# Altium schematic sheet controller.SchDoc
size A4; SheetNumber: 1; SheetTotal: 4
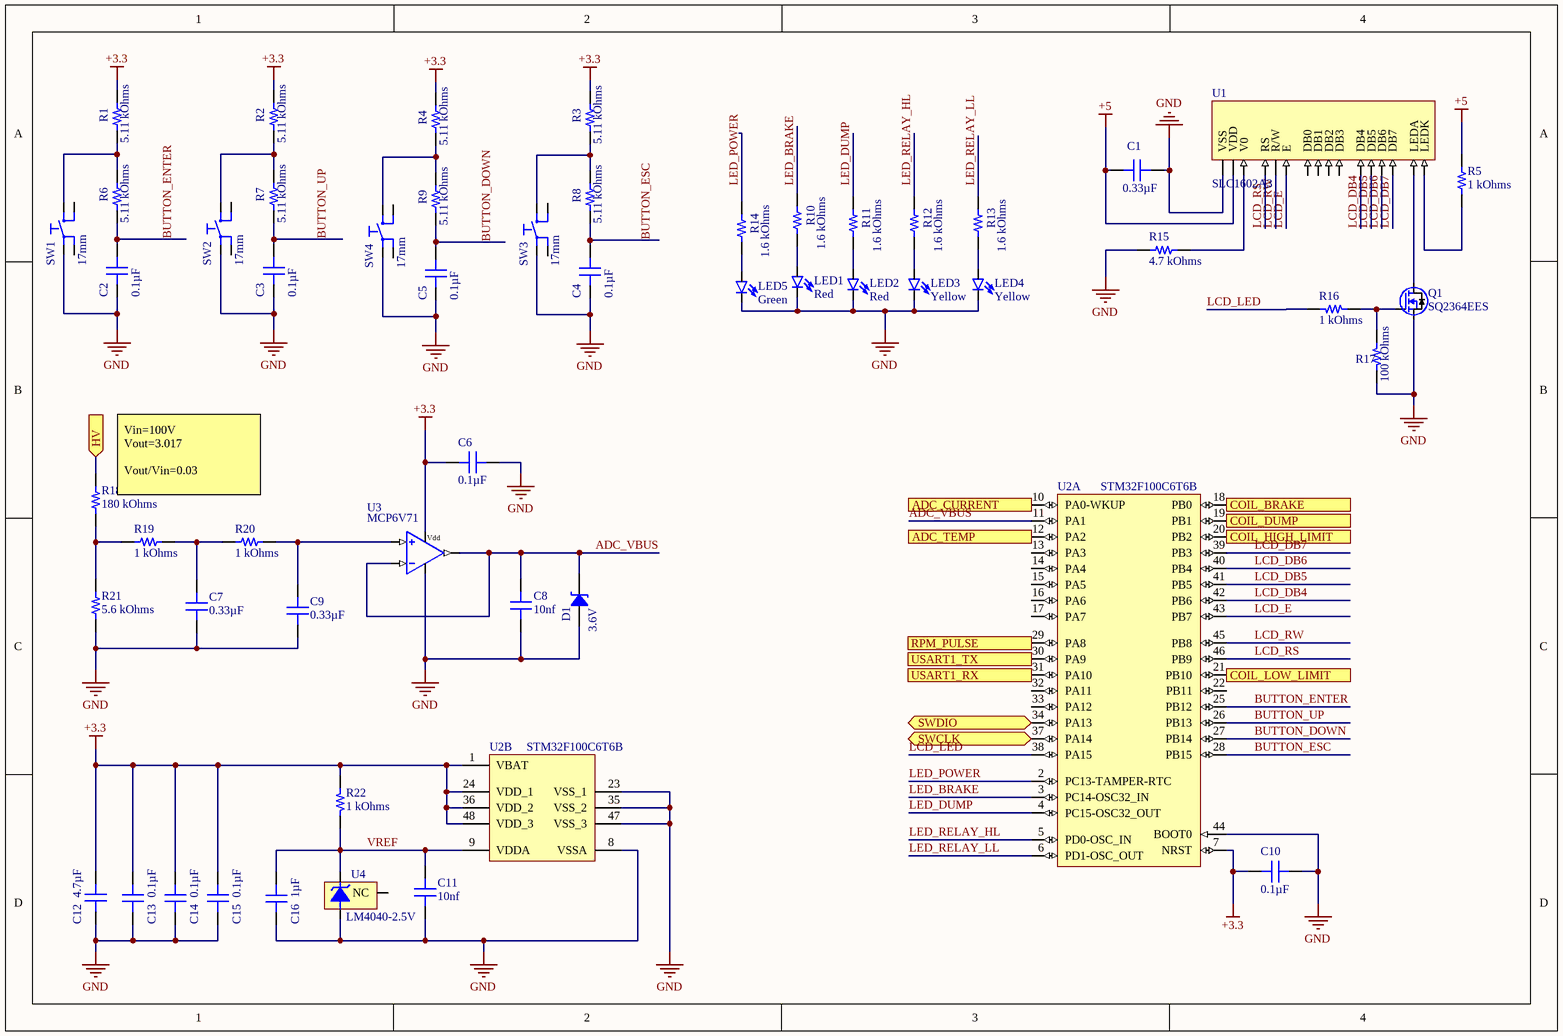
[diagram p0: controller.SchDoc]

## Parts
C1  0.33µF  [CAP 0805_2012]
C2  0.1µF  [CAP 0603_1608]
C3  0.1µF  [CAP 0603_1608]
C4  0.1µF  [CAP 0603_1608]
C5  0.1µF  [CAP 0603_1608]
C6  0.1µF  [CAP 0603_1608]
C7  0.33µF  [CAP 0805_2012]
C8  10nf  [CAP 0805_2012]
C9  0.33µF  [CAP 0805_2012]
C10  0.1µF  [CAP 0603_1608]
C11  10nf  [CAP 0402_1005]
C12  4.7µF  [CAP 0805_2012]
C13  0.1µF  [CAP 0603_1608]
C14  0.1µF  [CAP 0603_1608]
C15  0.1µF  [CAP 0603_1608]
C16  1µF  [CAP 0805_2012]
D1  3.6V  [SOD-123]
LED1  Red  [3mm LED THT]
LED2  Red  [3mm LED THT]
LED3  Yellow  [3mm LED THT]
LED4  Yellow  [3mm LED THT]
LED5  Green  [3mm LED THT]
Q1  SQ2364EES  [SOT23-(SQ2364EES)_H]
R1  5.11 kOhms  [RES 1206_3216]
R2  5.11 kOhms  [RES 1206_3216]
R3  5.11 kOhms  [RES 1206_3216]
R4  5.11 kOhms  [RES 1206_3216]
R5  1 kOhms  [RES 1206_3216]
R6  5.11 kOhms  [RES 1206_3216]
R7  5.11 kOhms  [RES 1206_3216]
R8  5.11 kOhms  [RES 1206_3216]
R9  5.11 kOhms  [RES 1206_3216]
R10  1.6 kOhms  [RES 1206_3216]
R11  1.6 kOhms  [RES 1206_3216]
R12  1.6 kOhms  [RES 1206_3216]
R13  1.6 kOhms  [RES 1206_3216]
R14  1.6 kOhms  [RES 1206_3216]
R15  4.7 kOhms  [RES 1206_3216]
R16  1 kOhms  [RES 1206_3216]
R17  100 kOhms  [RES 1206_3216]
R18  180 kOhms  [RES 1206_3216]
R19  1 kOhms  [RES 1206_3216]
R20  1 kOhms  [RES 1206_3216]
R21  5.6 kOhms  [RES 1206_3216]
R22  1 kOhms  [RES 1206_3216]
SW1  17mm  [6x6x17_THT]
SW2  17mm  [6x6x17_THT]
SW3  17mm  [6x6x17_THT]
SW4  17mm  [6x6x17_THT]
U1  SLC1602A3  [2x16 Lcd Top Left 36x80mm]
U2  STM32F100C6T6B  [STM-LQFP48_M]  (parts A,B of 2)
U3  MCP6V71  [SOT23-5-MCP6V71_H]
U4  LM4040-2.5V  [MF03A_L]

## Ports
ADC_CURRENT (in), ADC_TEMP (in), COIL_BRAKE (out), COIL_DUMP (out), COIL_HIGH_LIMIT (out), COIL_LOW_LIMIT (out), HV (in), RPM_PULSE (in), SWCLK (bidir), SWDIO (bidir), USART1_RX (in), USART1_TX (out)

## Nets
+3.3: C6.2 C10.2 C12.2 C13.2 C14.2 C15.2 R1.2 R2.2 R3.2 R4.2 R22.1 U2.1(VBAT) U2.7(NRST) U2.24(VDD_1) U2.36(VDD_2) U2.48(VDD_3) U3.5(VDD)
+5: C1.2 R5.2 U1.2(VDD)
GND: C1.1 C2.1 C3.1 C4.1 C5.1 C6.1 C7.1 C8.1 C9.1 C10.1 C11.1 C12.1 C13.1 C14.1 C15.1 C16.1 D1.1 LED1.A LED2.A LED3.A LED4.A LED5.A Q1.2(S) R15.1 R17.1 R21.1 SW1.1 SW2.1 SW3.1 SW4.1 U1.1(VSS) U2.8(VSSA) U2.23(VSS_1) U2.35(VSS_2) U2.44(BOOT0) U2.47(VSS_3) U3.2(VSS) U4.2(-V)
ADC_CURRENT: U2.10(PA0-WKUP) ; port ADC_CURRENT
ADC_TEMP: U2.12(PA2) ; port ADC_TEMP
ADC_VBUS: C8.2 D1.2 U2.11(PA1) U3.3(Vin(-)) U3.4(Out)
BUTTON_DOWN: C5.2 R9.1 U2.27(PB14)
BUTTON_ENTER: C2.2 R6.1 U2.25(PB12)
BUTTON_ESC: C4.2 R8.1 U2.28(PB15)
BUTTON_UP: C3.2 R7.1 U2.26(PB13)
COIL_BRAKE: U2.18(PB0) ; port COIL_BRAKE
COIL_DUMP: U2.19(PB1) ; port COIL_DUMP
COIL_HIGH_LIMIT: U2.20(PB2) ; port COIL_HIGH_LIMIT
COIL_LOW_LIMIT: U2.21(PB10) ; port COIL_LOW_LIMIT
HV: R18.2 ; port HV
LCD_DB4: U1.11(DB4) U2.42(PB6)
LCD_DB5: U1.12(DB5) U2.41(PB5)
LCD_DB6: U1.13(DB6) U2.40(PB4)
LCD_DB7: U1.14(DB7) U2.39(PB3)
LCD_E: U1.6(E) U2.43(PB7)
LCD_LED: R16.2 U2.38(PA15)
LCD_RS: U1.4(RS) U2.46(PB9)
LCD_RW: U1.5(R/W) U2.45(PB8)
LED_BRAKE: R10.2 U2.3(PC14-OSC32_IN)
LED_DUMP: R11.2 U2.4(PC15-OSC32_OUT)
LED_POWER: R14.2 U2.2(PC13-TAMPER-RTC)
LED_RELAY_HL: R12.2 U2.5(PD0-OSC_IN)
LED_RELAY_LL: R13.2 U2.6(PD1-OSC_OUT)
RPM_PULSE: U2.29(PA8) ; port RPM_PULSE
SWCLK: U2.37(PA14) ; port SWCLK
SWDIO: U2.34(PA13) ; port SWDIO
USART1_RX: U2.31(PA10) ; port USART1_RX
USART1_TX: U2.30(PA9) ; port USART1_TX
VREF: C11.2 C16.2 R22.2 U2.9(VDDA) U4.1(+V)
NetC7_2: C7.2 R19.2 R20.1
NetC9_2: C9.2 R20.2 U3.1(Vin(+))
NetLED1_C: LED1.C R10.1
NetLED2_C: LED2.C R11.1
NetLED3_C: LED3.C R12.1
NetLED4_C: LED4.C R13.1
NetLED5_C: LED5.C R14.1
NetQ1_1: Q1.1(G) R16.1 R17.2
NetQ1_3: Q1.3(D) U1.15(LEDA)
NetR1_1: R1.1 R6.2 SW1.2
NetR2_1: R2.1 R7.2 SW2.2
NetR3_1: R3.1 R8.2 SW3.2
NetR4_1: R4.1 R9.2 SW4.2
NetR5_1: R5.1 U1.16(LEDK)
NetR15_2: R15.2 U1.3(V0)
NetR18_1: R18.1 R19.1 R21.2

Not connected (* = marked no-connect by the designer): SW1 3 4; SW2 3 4; SW3 3 4; SW4 3 4; U1 7(DB0) 8(DB1) 9(DB2) 10(DB3); U2 13(PA3) 14(PA4) 15(PA5) 16(PA6) 17(PA7) 22(PB11) 32(PA11) 33(PA12); U4 3(NC)

## Notes on the sheet
- (near R18) Vin=100V
  Vout=3.017
  Vout/Vin=0.03
- (in symbol MCP6V71UT-E/LTY) Vdd

## Library data of the parts
C1 C7 C9 = C0805C334K5RECAUTO: CAP CER 0805 330NF 50V X7R 10%; Manufacturer: KEMET; Part Number: C0805C334K5RECAUTO; Value: 0.33µF; Applications: Automotive, ESD Protection; Capacitance: 0.33µF; ComponentLink1Description: Datasheet; ComponentLink1URL: https://api.kemet.com/component-edge/download/datasheet/C0805C334K5RECAUTO.pdf; ComponentLink2Description: DigiKey Link; ComponentLink2URL: http://digikey.com/product-detail/en/kemet/C0805C334K5RECAUTO/399-17888-1-ND/8640555; Device Package: 0805 (2012 Metric); LastUpdated: 9/2/2020 1:04:15 AM; Lifecycle Status: Active; Minimum Order: 1; Mounting Type: Surface Mount, MLCC; Operating Temperature: -55°C ~ 125°C; Package / Case: 0805 (2012 Metric); Packaging: TapeAndReel; PartId: 15715; Part Status: Active; Price: 0.05; Ratings: AEC-Q200; Series: ESD SMD Auto X7R; Size / Dimension: 0.079" L x 0.049" W (2.00mm x 1.25mm); Supplier 1: DigiKey; Supplier Part Number 1: 399-17888-1-ND; Temperature Coefficient: X7R; Thickness (Max): 0.039" (1.00mm); Tolerance: ±10%; Voltage - Rated: 50V
C2-C6 C10 C13-C15 = CGA3E2X7R1H104K080AE: CAP CER 0.1UF 50V X7R 0603; Manufacturer: TDK Corporation; Tolerance: ±10%; Part Number: CGA3E2X7R1H104K080AE; Value: 0.1µF; Applications: Automotive, Boardflex Sensitive; Capacitance: 0.1µF; ComponentLink1Description: Datasheet; ComponentLink1URL: https://product.tdk.com/info/en/catalog/datasheets/mlcc_automotive_soft_en.pdf?ref_disty=digikey; ComponentLink2Description: DigiKey Link; ComponentLink2URL: http://digikey.com/product-detail/en/tdk-corporation/CGA3E2X7R1H104K080AE/445-15957-1-ND/4490665; Device Package: 0603 (1608 Metric); Features: Soft Termination; LastUpdated: 9/2/2020 1:03:35 AM; Lifecycle Status: Active; Minimum Order: 1; Mounting Type: Surface Mount, MLCC; Operating Temperature: -55°C ~ 125°C; Package / Case: 0603 (1608 Metric); Packaging: TapeAndReel; PartId: 2715; Part Status: Active; Price: 0.02; Ratings: AEC-Q200; Series: CGA; Size / Dimension: 0.063" L x 0.031" W (1.60mm x 0.80mm); Supplier 1: DigiKey; Supplier Part Number 1: 445-15957-1-ND; Temperature Coefficient: X7R; Thickness (Max): 0.035" (0.90mm); Voltage - Rated: 50V
C8 = C0805X103K1RAC3316: CAP CER 0805 10NF 100V X7R; Manufacturer: KEMET; Capacitance: 10000pF; Tolerance: ±10%; Part Number: C0805X103K1RAC3316; Value: 10nf; Applications: Automotive, Boardflex Sensitive; ComponentLink1Description: Datasheet; ComponentLink1URL: https://api.kemet.com/component-edge/download/datasheet/C0805X103K1RAC3316.pdf; ComponentLink2Description: DigiKey Link; ComponentLink2URL: http://digikey.com/product-detail/en/kemet/C0805X103K1RAC3316/399-C0805X103K1RAC3316CT-ND/10315836; Device Package: 0805 (2012 Metric); Features: Soft Termination; LastUpdated: 9/2/2020 1:04:42 AM; Lifecycle Status: Active; Minimum Order: 1; Mounting Type: Surface Mount, MLCC; Operating Temperature: -55°C ~ 125°C; Package / Case: 0805 (2012 Metric); Packaging: TapeAndReel; PartId: 2565; Part Status: Active; Price: 0.02; Ratings: AEC-Q200; Series: SMD Auto X7R VW80808; Size / Dimension: 0.079" L x 0.049" W (2.00mm x 1.25mm); Supplier 1: DigiKey; Supplier Part Number 1: 399-C0805X103K1RAC3316CT-ND; Temperature Coefficient: X7R; Thickness (Max): 0.039" (0.98mm); Voltage - Rated: 100V
C11 = C0402C103K4RECAUTO: CAP CER 0402 10NF 16V X7R 10%; Manufacturer: KEMET; Voltage - Rated: 50V; Part Number: C0402C103K4RECAUTO; Value: 10nf; Applications: Automotive, ESD Protection; Capacitance: 10nf; ComponentLink1Description: Datasheet; ComponentLink1URL: https://api.kemet.com/component-edge/download/datasheet/C0402C103K4RECAUTO.pdf; ComponentLink2Description: DigiKey Link; ComponentLink2URL: http://digikey.com/product-detail/en/kemet/C0402C103K4RECAUTO/399-17876-1-ND/8640543; Device Package: 0402 (1005 Metric); LastUpdated: 9/2/2020 1:02:25 AM; Lifecycle Status: Active; Minimum Order: 1; Mounting Type: Surface Mount, MLCC; Operating Temperature: -55°C ~ 125°C; Package / Case: 0402 (1005 Metric); Packaging: TapeAndReel; PartId: 1725; Part Status: Active; Price: 0.02; Ratings: AEC-Q200; Series: ESD SMD Auto X7R; Size / Dimension: 0.039" L x 0.020" W (1.00mm x 0.50mm); Supplier 1: DigiKey; Supplier Part Number 1: 399-17876-1-ND; Temperature Coefficient: X7R; Thickness (Max): 0.022" (0.55mm); Tolerance: ±10%
C12 = CL21A475KBQNNNE: CAP CER 4.7UF 50V X5R 0805; Manufacturer: Samsung Electro-Mechanics; Tolerance: ±10%; Part Number: CL21A475KBQNNNE; Value: 4.7µF; Applications: General Purpose; Capacitance: 4.7µF; ComponentLink1Description: Datasheet; ComponentLink1URL: http://www.samsungsem.com/kr/support/product-search/mlcc/CL21A475KBQNNNE.jsp; ComponentLink2Description: DigiKey Link; ComponentLink2URL: http://digikey.com/product-detail/en/samsung-electro-mechanics/CL21A475KBQNNNE/1276-1248-1-ND/3889334; Device Package: 0805 (2012 Metric); LastUpdated: 9/2/2020 1:04:41 AM; Lifecycle Status: Active; Minimum Order: 1; Mounting Type: Surface Mount, MLCC; Operating Temperature: -55°C ~ 85°C; Package / Case: 0805 (2012 Metric); Packaging: TapeAndReel; PartId: 3027; Part Status: Active; Price: 0.10; Series: CL; Size / Dimension: 0.079" L x 0.049" W (2.00mm x 1.25mm); Supplier 1: DigiKey; Supplier Part Number 1: 1276-1248-1-ND; Temperature Coefficient: X5R; Thickness (Max): 0.055" (1.40mm); Voltage - Rated: 50V
C16 = 08055C105K4Z2A: CAP CER 1UF 50V X7R 0805; Manufacturer: AVX Corporation; Tolerance: ±10%; Part Number: 08055C105K4Z2A; Value: 1µF; Applications: Automotive, Boardflex Sensitive; Capacitance: 1µF; ComponentLink1Description: Datasheet; ComponentLink1URL: http://datasheets.avx.com/FlexitermMLCC.pdf; ComponentLink2Description: DigiKey Link; ComponentLink2URL: http://digikey.com/product-detail/en/avx-corporation/08055C105K4Z2A/478-9557-1-ND/5322895; Device Package: 0805 (2012 Metric); Features: Soft Termination; LastUpdated: 9/2/2020 1:04:41 AM; Lifecycle Status: Active; Minimum Order: 1; Mounting Type: Surface Mount, MLCC; Operating Temperature: -55°C ~ 125°C; Package / Case: 0805 (2012 Metric); Packaging: TapeAndReel; PartId: 2983; Part Status: Active; Price: 0.09; Ratings: AEC-Q200; Series: FLEXITERM®; Size / Dimension: 0.079" L x 0.049" W (2.00mm x 1.25mm); Supplier 1: DigiKey; Supplier Part Number 1: 478-9557-1-ND; Temperature Coefficient: X7R; Thickness (Max): 0.055" (1.40mm); Voltage - Rated: 50V
D1 = MMSZ3V6T1G: DIODE ZENER 3.6V 500MW SOD123; Manufacturer: ON Semiconductor; Current - Reverse Leakage @ Vr: 5µA @ 1V; Impedance (Max) (Zzt): 90 Ohms; Tolerance: ±5%; Voltage - Forward (Vf) (Max) @ If: 900mV @ 10mA; Part Number: MMSZ3V6T1G; ComponentLink1Description: Datasheet; ComponentLink1URL: http://www.onsemi.com/pub/Collateral/MMSZ2V4T1-D.PDF; ComponentLink2Description: DigiKey Link; ComponentLink2URL: http://digikey.com/product-detail/en/on-semiconductor/MMSZ3V6T1G/MMSZ3V6T1GOSCT-ND/2121110; LastUpdated: 9/2/2020 1:19:27 AM; Lifecycle Status: Active; Minimum Order: 1; Mounting Type: Surface Mount; Operating Temperature: -55°C ~ 150°C; Package / Case: SOD-123; Packaging: TapeAndReel; PartId: 1892; Part Status: Active; Power - Max: 500mW; Price: 0.04; Series: -; Supplier 1: DigiKey; Supplier Part Number 1: MMSZ3V6T1GOSCT-ND; Supplier Device Package: SOD-123; Voltage - Zener (Nom) (Vz): 3.6V
LED1 LED2 = 3mm led red THT: Color: Red
LED3 LED4 = 3mm led yellow THT: Color: Yellow
LED5 = 3mm led green THT: Color: Green
Q1 = SQ2364EES: Trans MOSFET N-CH 60V 2A Automotive 3-Pin SOT-23 T/R; Manufacturer: Vishay; Manufacturer Part Number: SQ2364EES-T1_GE3; Supplier 1: Digi-Key; RoHS: No; Stock 1: 15433; Pricing 1: 1=0.61000, 10=0.52300, 25=0.48960, 100=0.36380, 500=0.28404, 1000=0.23087 (USD); ComponentLink1URL: http://www.farnell.com/datasheets/2611857.pdf?src-supplier=Farnell; ComponentLink1Description: http://www.farnell.com/datasheets/2611857.pdf?src-supplier=Farnell; ComponentLink2URL: http://www.farnell.com/datasheets/2611857.pdf?src-supplier=Newark; ComponentLink2Description: http://www.farnell.com/datasheets/2611857.pdf?src-supplier=Newark
R1-R4 R6-R9 = RK73H2BTTD5111F: RES 5.11K OHM 1% 1/4W 1206; Manufacturer: KOA Speer Electronics, Inc.; Power (Watts): 0.25W, 1/4W; Temperature Coefficient: ±100ppm/°C; Part Number: RK73H2BTTD5111F; ComponentLink1Description: Datasheet; ComponentLink1URL: http://www.koaspeer.com/catimages/Products/RK73H/RK73H.pdf; ComponentLink2Description: DigiKey Link; ComponentLink2URL: http://digikey.com/product-detail/en/koa-speer-electronics-inc/RK73H2BTTD5111F/2019-RK73H2BTTD5111FCT-ND/10238090; Composition: Thick Film; Device Package: 1206 (3216 Metric); Features: Automotive AEC-Q200, Moisture Resistant; Height - Seated (Max): 0.028" (0.70mm); LastUpdated: 9/2/2020 1:13:09 AM; Lifecycle Status: Active; Minimum Order: 1; Number of Terminations: 2; Operating Temperature: -55°C ~ 155°C; Package / Case: 1206 (3216 Metric); Packaging: TapeAndReel; PartId: 27190; Part Status: Active; Price: 0.01; Ratings: AEC-Q200; Resistance: 5.11 kOhms; Series: RK73H; Size / Dimension: 0.126" L x 0.063" W (3.20mm x 1.60mm); Supplier 1: DigiKey; Supplier Part Number 1: 2019-RK73H2BTTD5111FCT-ND; Supplier Device Package: 1206; Tolerance: ±1%; Value: 5.11 kOhms
R5 = CRG1206F1K0: RES SMD 1K OHM 1% 1/4W 1206; Manufacturer: TE Connectivity Passive Product; Power (Watts): 0.25W, 1/4W; Temperature Coefficient: ±100ppm/°C; Part Number: CRG1206F1K0; ComponentLink1Description: Datasheet; ComponentLink1URL: https://www.te.com/commerce/DocumentDelivery/DDEController?Action=srchrtrv&DocNm=1773204&DocType=DS&DocLang=English; ComponentLink2Description: DigiKey Link; ComponentLink2URL: http://digikey.com/product-detail/en/te-connectivity-passive-product/CRG1206F1K0/A106070CT-ND/3477722; Composition: Thick Film; Device Package: 1206 (3216 Metric); Height - Seated (Max): 0.026" (0.65mm); LastUpdated: 9/2/2020 1:13:10 AM; Lifecycle Status: Active; Minimum Order: 1; Number of Terminations: 2; Operating Temperature: -55°C ~ 155°C; Package / Case: 1206 (3216 Metric); Packaging: TapeAndReel; PartId: 26986; Part Status: Active; Price: 0.01; Resistance: 1 kOhms; Series: CRG, Neohm; Size / Dimension: 0.122" L x 0.061" W (3.10mm x 1.55mm); Supplier 1: DigiKey; Supplier Part Number 1: A106070CT-ND; Supplier Device Package: 1206; Tolerance: ±1%; Value: 1 kOhms
R10-R14 = CRCW12061K60FKEA: RES SMD 1.6K OHM 1% 1/4W 1206; Manufacturer: Vishay Dale; Power (Watts): 0.25W, 1/4W; Temperature Coefficient: ±100ppm/°C; Part Number: CRCW12061K60FKEA; ComponentLink1Description: Datasheet; ComponentLink1URL: http://www.vishay.com/docs/20035/dcrcwe3.pdf; ComponentLink2Description: DigiKey Link; ComponentLink2URL: http://digikey.com/product-detail/en/vishay-dale/CRCW12061K60FKEA/541-1.60KFCT-ND/1181781; Composition: Thick Film; Device Package: 1206 (3216 Metric); Features: Automotive AEC-Q200; Height - Seated (Max): 0.024" (0.60mm); LastUpdated: 9/2/2020 1:13:08 AM; Lifecycle Status: Active; Minimum Order: 1; Number of Terminations: 2; Operating Temperature: -55°C ~ 155°C; Package / Case: 1206 (3216 Metric); Packaging: TapeAndReel; PartId: 27577; Part Status: Active; Price: 0.01; Ratings: AEC-Q200; Resistance: 1.6 kOhms; Series: CRCW; Size / Dimension: 0.126" L x 0.063" W (3.20mm x 1.60mm); Supplier 1: DigiKey; Supplier Part Number 1: 541-1.60KFCT-ND; Supplier Device Package: 1206; Tolerance: ±1%; Value: 1.6 kOhms
R15 = CRG1206F4K7: RES SMD 4.7K OHM 1% 1/4W 1206; Manufacturer: TE Connectivity Passive Product; Power (Watts): 0.25W, 1/4W; Temperature Coefficient: ±100ppm/°C; Part Number: CRG1206F4K7; ComponentLink1Description: Datasheet; ComponentLink1URL: https://www.te.com/commerce/DocumentDelivery/DDEController?Action=srchrtrv&DocNm=1773204&DocType=DS&DocLang=English; ComponentLink2Description: DigiKey Link; ComponentLink2URL: http://digikey.com/product-detail/en/te-connectivity-passive-product/CRG1206F4K7/A106078CT-ND/3477735; Composition: Thick Film; Device Package: 1206 (3216 Metric); Height - Seated (Max): 0.026" (0.65mm); LastUpdated: 9/2/2020 1:13:10 AM; Lifecycle Status: Active; Minimum Order: 1; Number of Terminations: 2; Operating Temperature: -55°C ~ 155°C; Package / Case: 1206 (3216 Metric); Packaging: TapeAndReel; PartId: 26987; Part Status: Active; Price: 0.01; Resistance: 4.7 kOhms; Series: CRG, Neohm; Size / Dimension: 0.122" L x 0.061" W (3.10mm x 1.55mm); Supplier 1: DigiKey; Supplier Part Number 1: A106078CT-ND; Supplier Device Package: 1206; Tolerance: ±1%; Value: 4.7 kOhms
R16 R19 R20 R22 = RC1206FR-071KL: RES SMD 1K OHM 1% 1/4W 1206; Manufacturer: Yageo; Power (Watts): 0.25W, 1/4W; Temperature Coefficient: ±100ppm/°C; Part Number: RC1206FR-071KL; ComponentLink1Description: Datasheet; ComponentLink1URL: https://www.yageo.com/upload/media/product/productsearch/datasheet/rchip/PYu-RC_Group_51_RoHS_L_10.pdf; ComponentLink2Description: DigiKey Link; ComponentLink2URL: http://digikey.com/product-detail/en/yageo/RC1206FR-071KL/311-1.00KFRCT-ND/731334; Composition: Thick Film; Device Package: 1206 (3216 Metric); Features: Moisture Resistant; Height - Seated (Max): 0.026" (0.65mm); LastUpdated: 9/2/2020 1:13:10 AM; Lifecycle Status: Active; Minimum Order: 1; Number of Terminations: 2; Operating Temperature: -55°C ~ 155°C; Package / Case: 1206 (3216 Metric); Packaging: TapeAndReel; PartId: 26978; Part Status: Active; Price: 0.01; Resistance: 1 kOhms; Series: RC; Size / Dimension: 0.122" L x 0.063" W (3.10mm x 1.60mm); Supplier 1: DigiKey; Supplier Part Number 1: 311-1.00KFRCT-ND; Supplier Device Package: 1206; Tolerance: ±1%; Value: 1 kOhms
R17 = CRG1206F100K: RES SMD 100K OHM 1% 1/4W 1206; Manufacturer: TE Connectivity Passive Product; Power (Watts): 0.25W, 1/4W; Temperature Coefficient: ±100ppm/°C; Part Number: CRG1206F100K; ComponentLink1Description: Datasheet; ComponentLink1URL: https://www.te.com/commerce/DocumentDelivery/DDEController?Action=srchrtrv&DocNm=1773204&DocType=DS&DocLang=English; ComponentLink2Description: DigiKey Link; ComponentLink2URL: http://digikey.com/product-detail/en/te-connectivity-passive-product/CRG1206F100K/A106067CT-ND/3477717; Composition: Thick Film; Device Package: 1206 (3216 Metric); Height - Seated (Max): 0.026" (0.65mm); LastUpdated: 9/2/2020 1:13:10 AM; Lifecycle Status: Active; Minimum Order: 1; Number of Terminations: 2; Operating Temperature: -55°C ~ 155°C; Package / Case: 1206 (3216 Metric); Packaging: TapeAndReel; PartId: 26988; Part Status: Active; Price: 0.01; Resistance: 100 kOhms; Series: CRG, Neohm; Size / Dimension: 0.122" L x 0.061" W (3.10mm x 1.55mm); Supplier 1: DigiKey; Supplier Part Number 1: A106067CT-ND; Supplier Device Package: 1206; Tolerance: ±1%; Value: 100 kOhms
R18 = CRCW1206180KFKEA: RES SMD 180K OHM 1% 1/4W 1206; Manufacturer: Vishay Dale; Power (Watts): 0.25W, 1/4W; Temperature Coefficient: ±100ppm/°C; Part Number: CRCW1206180KFKEA; ComponentLink1Description: Datasheet; ComponentLink1URL: http://www.vishay.com/docs/20035/dcrcwe3.pdf; ComponentLink2Description: DigiKey Link; ComponentLink2URL: http://digikey.com/product-detail/en/vishay-dale/CRCW1206180KFKEA/541-180KFCT-ND/1182015; Composition: Thick Film; Device Package: 1206 (3216 Metric); Features: Automotive AEC-Q200; Height - Seated (Max): 0.024" (0.60mm); LastUpdated: 9/2/2020 1:12:53 AM; Lifecycle Status: Active; Minimum Order: 1; Number of Terminations: 2; Operating Temperature: -55°C ~ 155°C; Package / Case: 1206 (3216 Metric); Packaging: TapeAndReel; PartId: 33780; Part Status: Active; Price: 0.01; Ratings: AEC-Q200; Resistance: 180 kOhms; Series: CRCW; Size / Dimension: 0.126" L x 0.063" W (3.20mm x 1.60mm); Supplier 1: DigiKey; Supplier Part Number 1: 541-180KFCT-ND; Supplier Device Package: 1206; Tolerance: ±1%; Value: 180 kOhms
R21 = CRCW12065K60FKEA: RES SMD 5.6K OHM 1% 1/4W 1206; Manufacturer: Vishay Dale; Power (Watts): 0.25W, 1/4W; Temperature Coefficient: ±100ppm/°C; Part Number: CRCW12065K60FKEA; ComponentLink1Description: Datasheet; ComponentLink1URL: http://www.vishay.com/docs/20035/dcrcwe3.pdf; ComponentLink2Description: DigiKey Link; ComponentLink2URL: http://digikey.com/product-detail/en/vishay-dale/CRCW12065K60FKEA/541-5.60KFCT-ND/1181845; Composition: Thick Film; Device Package: 1206 (3216 Metric); Features: Automotive AEC-Q200; Height - Seated (Max): 0.024" (0.60mm); LastUpdated: 9/2/2020 1:13:06 AM; Lifecycle Status: Active; Minimum Order: 1; Number of Terminations: 2; Operating Temperature: -55°C ~ 155°C; Package / Case: 1206 (3216 Metric); Packaging: TapeAndReel; PartId: 28045; Part Status: Active; Price: 0.01; Ratings: AEC-Q200; Resistance: 5.6 kOhms; Series: CRCW; Size / Dimension: 0.126" L x 0.063" W (3.20mm x 1.60mm); Supplier 1: DigiKey; Supplier Part Number 1: 541-5.60KFCT-ND; Supplier Device Package: 1206; Tolerance: ±1%; Value: 5.6 kOhms
SW1-SW4 = 6x617 THT Vertical Tact: Black Button Tactile Switch, SPST-NO 50 mA @ 12 Vdc; Pitch: 17mm
U1 = SLC1602A3: 2x16 Charecter Lcd. Top left pin placement.
U2 = STM32F100C6T6B: ARM Cortex-M3 32-bit MCU, 32 KB Flash, 4 KB Internal RAM, 37 I/Os, 48-pin LQFP, -40 to 85 degC, Tray; D/A Converter: 2x12-bit (2 Channel); FLASH Size (Prog) (kB): 32; Internal RAM Size (kB): 4; Operating Frequency(F) (Processor speed) (MHz): 24; A/D Converter: 1x12-bit (10 Channel); Supply Voltage(Vcc) min (V): 2; I/Os (High Current): 37; ComponentLink3Description: Package Specification; PackageReference: LQFP48; ComponentLink2Description: Datasheet; ComponentLink1URL: http://www.st.com/web/en/home.html; ComponentLink3URL: http://www.st.com/st-web-ui/static/active/en/resource/technical/document/datasheet/DM00058181.pdf; Packing: Tray; ComponentLink2URL: http://www.st.com/st-web-ui/static/active/en/resource/technical/document/datasheet/CD00251732.pdf; Core: ARM Cortex-M3; ComponentLink1Description: Manufacturer URL; PackageDescription: 48-Pin Low Profile Quad Flat Package, 7 x 7 mm Body, 0.5 mm Pitch; Mounting Technology: Surface Mount; PartNumber: STM32F100C6T6B; PackageVersion: Rev. 6, 06/2013; DatasheetVersion: Rev. 7
U3 = MCP6V71UT-E/LTY: MICROCHIP         MCP6V71UT-E/LTY             OP-AMP, SINGLE, 2MHZ, 1V/US, SC-70-5; Min Supply Voltage: 2V; Max Supply Voltage: 5.5V; Voltage Gain: 137dB; Number of Circuits: 1; Slew Rate: 1V/µs; Input Bias Current: 1pA; Input Offset Voltage (Vos): 8uV; Operating Supply Current: 170uA; Output Current per Channel: 26mA; Common Mode Rejection Ratio: 111dB; Supplier 1: Digi-Key; Manufacturer: Microchip; Manufacturer Part Number: MCP6V71UT-E/LTY; RoHS: Yes; Category: Amplifiers - Op Amps, Buffer, Instrumentation; Stock 1: 2685; Pricing 1: 1=1.13000, 25=0.95000, 100=0.86000 (USD); Mount: Surface Mount; Case/Package: SC; Number of Pins: 70; Min Operating Temperature: -40°C; Max Operating Temperature: 125°C; Packaging: Cut Tape; Gain Bandwidth Product: 2MHz; Bandwidth: 2MHz; Number of Amplifiers: 1; REACH SVHC: No SVHC; Lead Free: Lead Free; RoHS Compliant: Yes; ComponentLink1URL: http://www.mouser.com/ds/2/268/20005385A-765176.pdf?src-supplier=Mouser; ComponentLink1Description: http://www.mouser.com/ds/2/268/20005385A-765176.pdf?src-supplier=Mouser; ComponentLink2URL: http://www.microchip.com/mymicrochip/filehandler.aspx?ddocname=en573422&src-supplier=Digi-Key; ComponentLink2Description: http://www.microchip.com/mymicrochip/filehandler.aspx?ddocname=en573422&src-supplier=Digi-Key; ComponentLink3URL: http://www.farnell.com/datasheets/1908127.pdf?src-supplier=Element14; ComponentLink3Description: http://www.farnell.com/datasheets/1908127.pdf?src-supplier=Element14; ComponentLink4URL: http://ww1.microchip.com/downloads/en/DeviceDoc/20005385A.pdf?src-supplier=Avnet; ComponentLink4Description: http://ww1.microchip.com/downloads/en/DeviceDoc/20005385A.pdf?src-supplier=Avnet; ComponentLink5URL: http://www.farnell.com/datasheets/1975751.pdf?src-supplier=Element14; ComponentLink5Description: http://www.farnell.com/datasheets/1975751.pdf?src-supplier=Element14
U4 = LM4040CIM3-2.5/NOPB: Precision Micropower Shunt Voltage Reference, 3-pin SOT-23, Pb-Free; Manufacturer: National Semiconductor; PowerWise: N; PackageTopMarking: R2C*XTT; CompType: Voltage Reference IC; PackageDescription: Molded SOT-23, .115 x .051 x .037in Body, 3 Lead, .075 in Pitch; ComponentLink3URL: http://www.national.com/packaging/folders/mf03a.html; ComponentLink3Description: MF03A Package Page; RoHS: Y; PinCount: 3; DatasheetVersion: Apr-2005; PackageReference: MF03A; RevisionNote: Component URLs added; ComponentLink2URL: http://www.national.com/pf/LM/LM4040.html; PackageVersion: revB, Mar-2003; ComponentLink2Description: LM4040 Web Page; ComponentLink1URL: http://www.national.com/ds/LM/LM4040.pdf; ComponentLink1Description: LM4040 Datasheet